# EAGLE schematic TouScruino-arm-ui2-v0 (EAGLE 6.3)
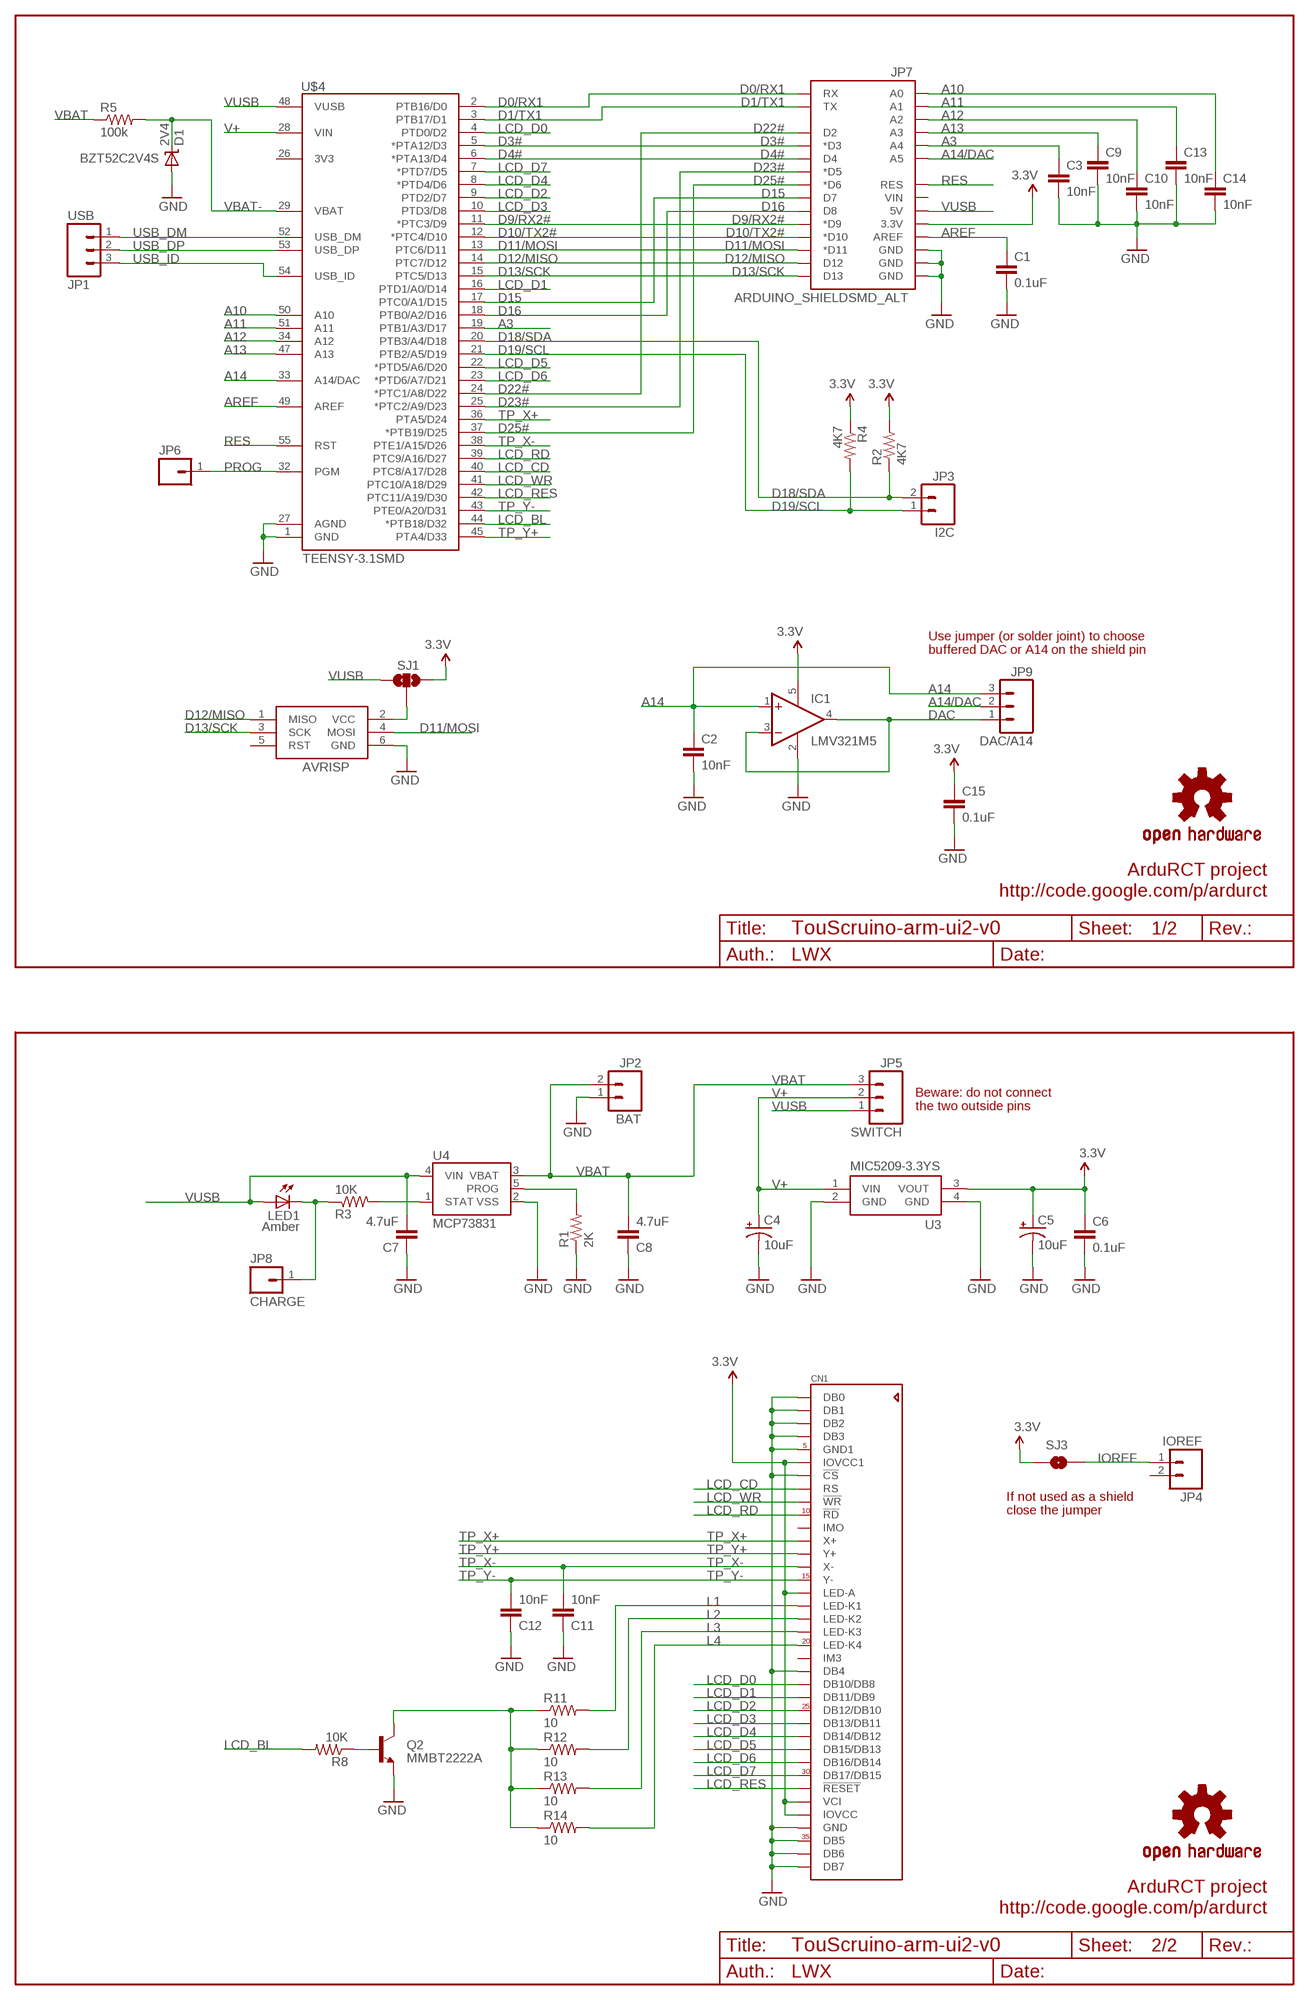
[diagram p0: schematic, sheet 1]

## Parts
AVRISP  AVRISP  [2X3_SMD]
C1  0.1uF  CAP0805  [0805]
C2  10nF  CAP0805  [0805]
C3  10nF  CAP0805  [0805]
C4  10uF  CAP_POL1206  [EIA3216]
C5  10uF  CAP_POL1206  [EIA3216]
C6  0.1uF  CAP0805  [0805]
C7  4.7uF  CAP0805  [0805]
C8  4.7uF  CAP0805  [0805]
C9  10nF  CAP0805  [0805]
C10  10nF  CAP0805  [0805]
C11  10nF  CAP0805  [0805]
C12  10nF  CAP0805  [0805]
C13  10nF  CAP0805  [0805]
C14  10nF  CAP0805  [0805]
C15  0.1uF  CAP0805  [0805]
CN1  ILI9325_LCD1.0MM  [ILI9325_28INCH_TS]
D1  2V4  DIODE-ZENER-BZT52  [SOD-323]
IC1  LMV321M5  [SOT23-5]
JP1  USB  M03SMD  [1X03_SMD_ALT]
JP2  BAT  M02-JST-2MM-SMT  [JST-2-SMD]
JP3  I2C  M02SMD_ALT  [1X02_SMD_ALT]
JP4  IOREF  M02SMD_ALT  [1X02_SMD_ALT]
JP5  SWITCH  M03SMD_TH  [1X03_SMD_TH]
JP6  M01SMD_TH  [1X01_SMD_TH]
JP7  ARDUINO_SHIELDSMD_ALT  [ARDUINO_SHIELD_SMD_ALT]
JP8  CHARGE  M01SMD  [1X01_SMD]
JP9  DAC/A14  M03SMD_SJ  [1X03_SMD_SJ]
LED1  Amber  LED  [LED]
Q2  MMBT2222A  TRANSISTOR_NPNSOT23-3  [SOT23-3]
R1  2K  RESISTOR0805-RES  [0805]
R2  4K7  RESISTOR0805-RES  [0805]
R3  10K  RESISTOR0805-RES  [0805]
R4  4K7  RESISTOR0805-RES  [0805]
R5  100k  RESISTOR0805-RES  [0805]
R8  10K  RESISTOR0805-RES  [0805]
R11  10  RESISTOR0805-RES  [0805]
R12  10  RESISTOR0805-RES  [0805]
R13  10  RESISTOR0805-RES  [0805]
R14  10  RESISTOR0805-RES  [0805]
SJ1  SJ_2WAYS  [SJ_2WAYS]
SJ3  SOLDERJUMPERNO  [SJ_2S-NO]
U3  MIC5209-3.3YS  MIC5209  [SOT223]
U4  MCP73831  [SOT23-5]
U$3  OSHW-LOGOM  [OSHW-LOGO-M]
U$4  TEENSY-3.1SMD  [TEENSY-3.1_HSMD]
U$5  OSHW-LOGOM  [OSHW-LOGO-M]

## Nets
3.3V: C5.A(+) C6.1 C15.1 CN1.6(IOVCC1) CN1.16(LED-A) CN1.32(VCI) CN1.33(IOVCC) IC1.5(V+) JP7.3.3V R2.2 R4.1 SJ1.3 SJ3.1 U3.3(VOUT)
A3: C3.1 JP7.A4 U$4.19(PTB1/A3/D17)
A10: C14.1 JP7.A0 U$4.50(A10)
A11: C13.1 JP7.A1 U$4.51(A11)
A12: C10.1 JP7.A2 U$4.34(A12)
A13: C9.1 JP7.A3 U$4.47(A13)
A14: C2.1 IC1.1(+IN) JP9.3 U$4.33(A14/DAC)
A14/DAC: JP7.A5 JP9.2
AREF: C1.1 JP7.AREF U$4.49(AREF)
D0/RX1: JP7.RX U$4.2(PTB16/D0)
D1/TX1: JP7.TX U$4.3(PTB17/D1)
D3#: JP7.D3(*D3) U$4.5(*PTA12/D3)
D4#: JP7.D4 U$4.6(*PTA13/D4)
D9/RX2#: JP7.D9(*D9) U$4.11(*PTC3/D9)
D10/TX2#: JP7.D10(*D10) U$4.12(*PTC4/D10)
D11/MOSI: AVRISP.4(MOSI) JP7.D11(*D11) U$4.13(PTC6/D11)
D12/MISO: AVRISP.1(MISO) JP7.D12 U$4.14(PTC7/D12)
D13/SCK: AVRISP.3(SCK) JP7.D13 U$4.15(PTC5/D13)
D15: JP7.D7 U$4.17(PTC0/A1/D15)
D16: JP7.D8 U$4.18(PTB0/A2/D16)
D18/SDA: JP3.2 R2.1 U$4.20(PTB3/A4/D18)
D19/SCL: JP3.1 R4.2 U$4.21(PTB2/A5/D19)
D22#: JP7.D2 U$4.24(*PTC1/A8/D22)
D23#: JP7.D5(*D5) U$4.25(*PTC2/A9/D23)
D25#: JP7.D6(*D6) U$4.37(*PTB19/D25)
DAC: IC1.3(-IN) IC1.4(OUT) JP9.1
GND [vcc]: AVRISP.6(GND) C1.2 C2.2 C3.2 C4.C(-) C5.C(-) C6.2 C7.1 C8.1 C9.2 C10.2 C11.1 C12.1 C13.2 C14.2 C15.2 CN1.1(DB0) CN1.2(DB1) CN1.3(DB2) CN1.4(DB3) CN1.5(GND1) CN1.7(!CS) CN1.22(DB4) CN1.34(GND) CN1.35(DB5) CN1.36(DB6) CN1.37(DB7) D1.2(A) IC1.2(V-) JP2.1 JP7.GND@0(GND) JP7.GND@1(GND) JP7.GND@2(GND) Q2.2(E) R1.1 U3.2(GND) U3.4(GND) U4.2(VSS) U$4.1(GND) U$4.27(AGND)
IOREF: JP4.1 SJ3.2
L1: CN1.17(LED-K1) R11.2
L2: CN1.18(LED-K2) R12.2
L3: CN1.19(LED-K3) R13.2
L4: CN1.20(LED-K4) R14.2
LCD_BL: R8.2 U$4.44(*PTB18/D32)
LCD_CD: CN1.8(RS) U$4.40(PTC8/A17/D28)
LCD_D0: CN1.23(DB10/DB8) U$4.4(PTD0/D2)
LCD_D1: CN1.24(DB11/DB9) U$4.16(PTD1/A0/D14)
LCD_D2: CN1.25(DB12/DB10) U$4.9(PTD2/D7)
LCD_D3: CN1.26(DB13/DB11) U$4.10(PTD3/D8)
LCD_D4: CN1.27(DB14/DB12) U$4.8(*PTD4/D6)
LCD_D5: CN1.28(DB15/DB13) U$4.22(*PTD5/A6/D20)
LCD_D6: CN1.29(DB16/DB14) U$4.23(*PTD6/A7/D21)
LCD_D7: CN1.30(DB17/DB15) U$4.7(*PTD7/D5)
LCD_RD: CN1.10(!RD) U$4.39(PTC9/A16/D27)
LCD_RES: CN1.31(!RESET) U$4.42(PTC11/A19/D30)
LCD_WR: CN1.9(!WR) U$4.41(PTC10/A18/D29)
N$2: AVRISP.2(VCC) SJ1.2
N$4: Q2.1(B) R8.1
N$7: Q2.3(C) R11.1 R12.1 R13.1 R14.1
N$8: JP8.1 LED1.C1(C) R3.1
N$12: R3.2 U4.1(STAT)
N$13: R1.2 U4.5(PROG)
PROG: JP6.1 U$4.32(PGM)
RES: JP7.RES U$4.55(RST)
TP_X+: CN1.12(X+) U$4.36(PTA5/D24)
TP_X-: C11.2 CN1.14(X-) U$4.38(PTE1/A15/D26)
TP_Y+: CN1.13(Y+) U$4.45(PTA4/D33)
TP_Y-: C12.2 CN1.15(Y-) U$4.43(PTE0/A20/D31)
USB_DM: JP1.1 U$4.52(USB_DM)
USB_DP: JP1.2 U$4.53(USB_DP)
USB_ID: JP1.3 U$4.54(USB_ID)
V+: C4.A(+) JP5.2 U3.1(VIN) U$4.28(VIN)
VBAT: C8.2 JP2.2 JP5.3 R5.1 U4.3(VBAT)
VBAT-: D1.1(C) R5.2 U$4.29(VBAT)
VUSB: C7.2 JP5.1 JP7.5V LED1.A1(A) SJ1.1 U4.4(VIN) U$4.48(VUSB)
Unconnected: AVRISP.5(RST) CN1.11(IMO) CN1.21(IM3) JP4.2 JP7.VIN U$4.26(3V3)

## Notes on the sheet
- BZT52C2V4S
- Use jumper (or solder joint) to choose 
  buffered DAC or A14 on the shield pin
- ArduRCT project
- http://code.google.com/p/ardurct
- 1/2
- LWX
- Beware: do not connect
  the two outside pins
- If not used as a shield
  close the jumper
- ArduRCT project
- http://code.google.com/p/ardurct
- 2/2
- LWX

## Library data of the parts
AVRISP = wibauxl:AVRISP
C1-C3 C6-C15 = SparkFun:CAP: Capacitor Standard 0603 ceramic capacitor, and 0.1" leaded capacitor.
C4 C5 = SparkFun:CAP_POL: Capacitor Polarized These are standard SMD and PTH capacitors. Normally 10uF, 47uF, and 100uF in electrolytic and tantalum varieties. Always verify the external diameter of the through hole cap, it varies with capacity, voltage, and manufacturer. The EIA devices should be standard.
CN1 = adafruit:ILI9325_LCD: 2.8" ILI9325-based TFT LCD w/Integrated Touch Screen
D1 = SparkFun:DIODE-ZENER: Zener Diode Production Part - 8199 3.4V Zener Voltage
IC1 = linear:LMV321?*: General Purpose, Low Voltage, Rail-to-Rail Output Operational Amplifiers Source: http://www.national.com/mpf/LM/LMV321.html http://www.national.com/dt/lmv_qual.pdf
JP1 JP5 JP9 = wibauxl:M03
JP2 = SparkFun:M02: Header 2 Standard 2-pin 0.1" header. Use with straight break away headers (SKU : PRT-00116), right angle break away headers (PRT-00553), swiss pins (PRT-00743), machine pins (PRT-00117), and female headers (PRT-00115). Molex polarized connector foot print use with SKU : PRT-08233 with associated crimp pins and housings.
JP3 JP4 = wibauxl:M02
JP6 JP8 = wibauxl:M01
JP7 = wibauxl:ARDUINO_SHIELD
LED1 = wibauxl:LED
Q2 = SparkFun:TRANSISTOR_NPN: Transistor NPN BJT configuration in SOT23 package. MMBT2222 is the common NPN we use. Double check BCE configuration again layout.
R1-R5 R8 R11-R14 = SparkFun:RESISTOR: Resistor Basic schematic elements and footprints for 0603, 1206, and PTH resistors.
SJ1 = wibauxl:SJ_2WAYS
SJ3 = SparkFun:SOLDERJUMPER: Solder Jumper Standard SMD solder jumper. Used to automate production. Two varients : Normally Open and Normally Closed are the same, but have different paste layers. NC will have a large amount of paste and should jumper during reflow.
U3 = wibauxl:MIC5209
U4 = SparkFun:MCP73831: Microchip's MCP73831 Miniature single cell, fully integrated Li-Ion, Li-polymer charge management controller http://ww1.microchip.com/downloads/en/DeviceDoc/21984a.pdf
U$3 U$5 = SparkFun:OSHW-LOGO: Open Source Hardware Logo This logo indicates the piece of hardware it is found on incorporates a OSHW license and/or adheres to the definition of open source hardware found here: http://freedomdefined.org/OSHW
U$4 = wibauxl:TEENSY-3.1

## Net classes
0 default: width 0.203 mm
1 vcc: width 0.254 mm
2 signal: width 0.305 mm